# Altium schematic sheet ControlBoard.SchDoc
size A4; SheetNumber: 1; SheetTotal: 1
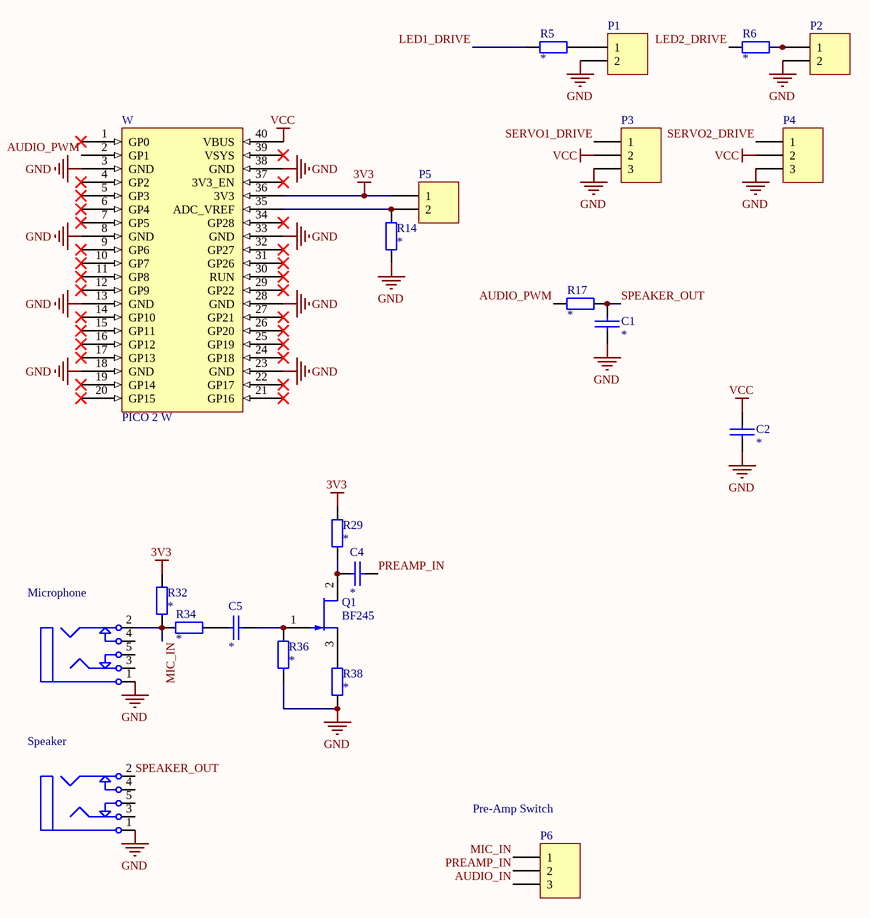
[diagram p0: ControlBoard.SchDoc]

## Parts
C1  *  [ece-CC2012-0805]
C2  *  [ece-CC2012-0805]
C4  *  [ece-CC2012-0805]
C5  *  [ece-CC2012-0805]
J1  Phonejack Stereo  [ECE-phonejackStereo]  (value not drawn)
J2  Phonejack Stereo  [ECE-phonejackStereo]  (value not drawn)
P1  Header 2  [ece-HDR1X2]  (value not drawn)
P2  Header 2  [ece-HDR1X2]  (value not drawn)
P3  Header 3  [ece-HDR1X3]  (value not drawn)
P4  Header 3  [ece-HDR1X3]  (value not drawn)
P5  Header 2  [ece-HDR1X2]  (value not drawn)
P6  Header 3  [ece-HDR1X3]  (value not drawn)
Q1  BF245  [ece-TO-92]
R5  *  [RESC2012-0805SM]
R6  *  [RESC2012-0805SM]
R14  *  [RESC2012-0805SM]
R17  *  [RESC2012-0805SM]
R29  *  [RESC2012-0805SM]
R32  *  [RESC2012-0805SM]
R34  *  [RESC2012-0805SM]
R36  *  [RESC2012-0805SM]
R38  *  [RESC2012-0805SM]
W  PICO 2 W  [DIP40]

## Nets
3V3: P5.1 R29.1 R32.2 W.36(3V3)
GND: C1.2 C2.2 J1.1 J2.1 P1.2 P2.2 P3.3 P4.3 R14.2 R36.2 R38.2 W.3(GND) W.8(GND) W.13(GND) W.18(GND) W.23(GND) W.28(GND) W.33(GND) W.38(GND)
VCC: C2.1 P3.2 P4.2 W.40(VBUS)
AUDIO_IN: P6.3
AUDIO_PWM: R17.2 W.2(GP1)
LED1_DRIVE: R5.1
LED2_DRIVE: R6.1
MIC_IN: J1.2 P6.1 R32.1 R34.2
PREAMP_IN: C4.2 P6.2
SERVO1_DRIVE: P3.1
SERVO2_DRIVE: P4.1
SPEAKER_OUT: C1.1 J2.2 R17.1
NetC4_1: C4.1 Q1.2(D) R29.2
NetC5_1: C5.1 R34.1
NetC5_2: C5.2 Q1.1(G) R36.1
NetP1_1: P1.1 R5.2
NetP2_1: P2.1 R6.2
NetP5_2: P5.2 R14.1 W.35(ADC_VREF)
NetQ1_3: Q1.3(S) R38.1

Not connected (* = marked no-connect by the designer): J1 3 4 5; J2 3 4 5; W 1(GP0)* 4(GP2)* 5(GP3)* 6(GP4)* 7(GP5)* 9(GP6)* 10(GP7)* 11(GP8)* 12(GP9)* 14(GP10)* 15(GP11)* 16(GP12)* 17(GP13)* 19(GP14)* 20(GP15)* 21(GP16)* 22(GP17)* 24(GP18)* 25(GP19)* 26(GP20)* 27(GP21)* 29(GP22)* 30(RUN)* 31(GP26)* 32(GP27)* 34(GP28)* 37(3V3_EN)* 39(VSYS)*

## Notes on the sheet
- (near J1) Microphone
- Speaker
- (near P6) Pre-Amp Switch

## Library data of the parts
C1 C2 C4 C5 = CAP SM0805: SM capacitor; Value: *
J1 J2 = Phonejack-Stereo
P1 P2 P5 = Header 2: Header, 2-Pin; LatestRevisionDate: 17-Jul-2002; LatestRevisionNote: Re-released for DXP Platform.; Publisher: Altium Limited
P3 P4 P6 = Header 3: Header, 3-Pin; LatestRevisionDate: 17-Jul-2002; LatestRevisionNote: Re-released for DXP Platform.; Publisher: Altium Limited
Q1 = BF245: N channel SFET; Value: BF245
R5 R6 R14 R17 R29 R32 R34 R36 R38 = Res SM 0805: SM resistor; Value: *
W = CMP-020-00023-1: The PICO 2 W throughhole symbol thing; Case/Package: DIP40